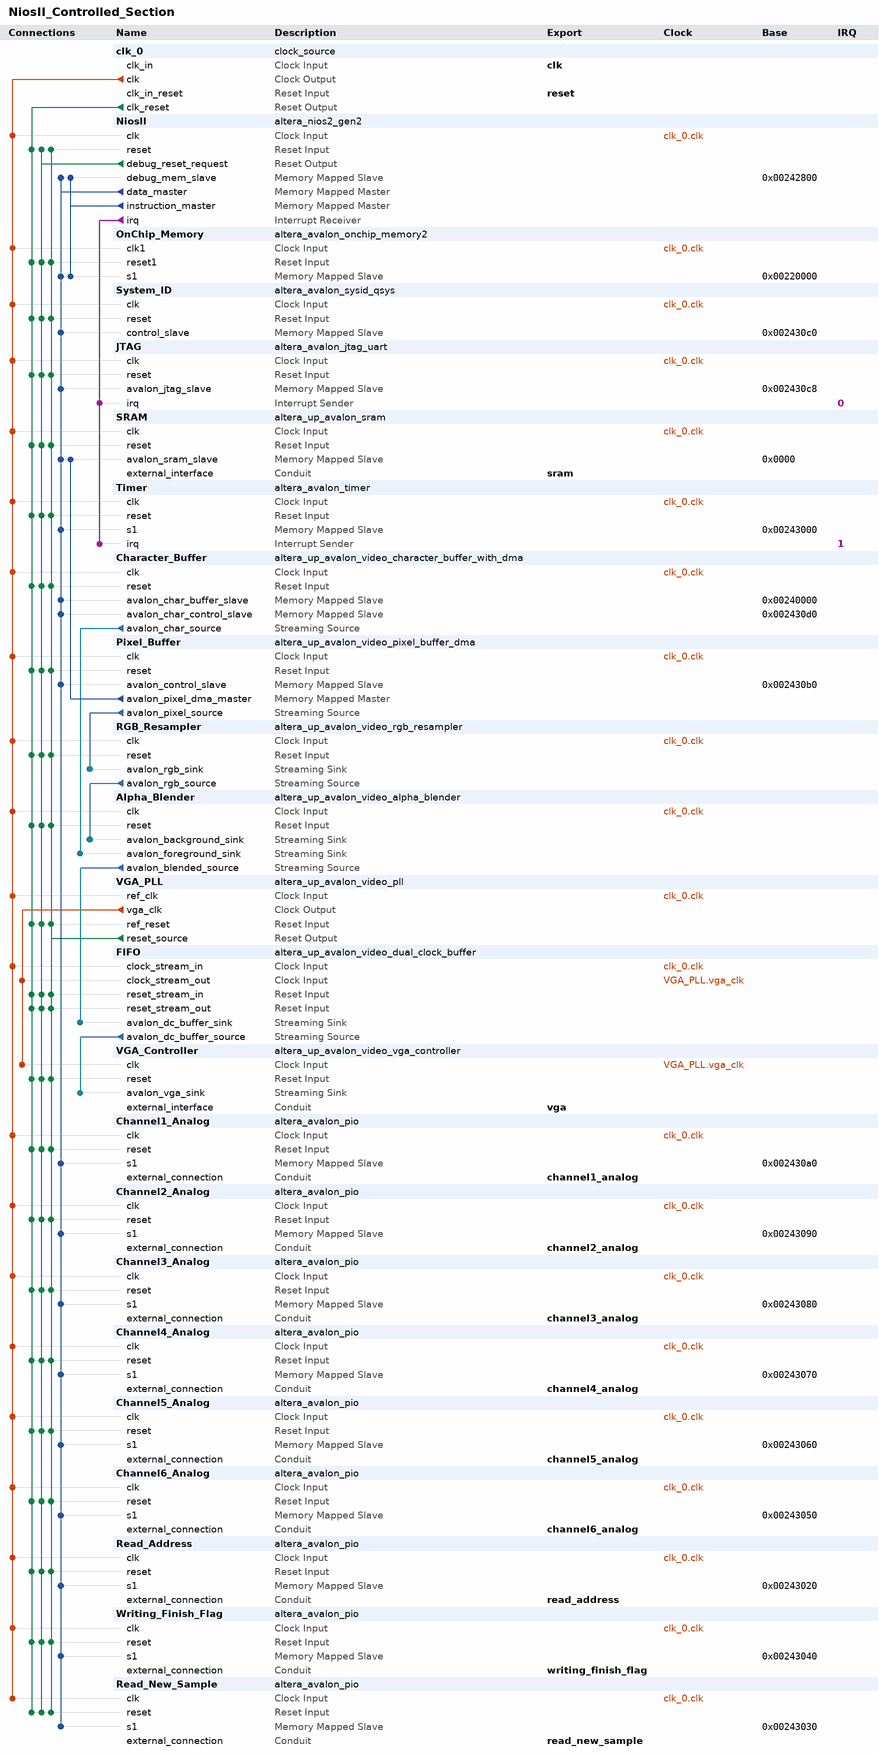
[diagram p0: system contents]
# Platform Designer (Qsys) system NiosII_Controlled_Section, Cyclone IV E EP4CE115F29C7
# Parameters at their usual value, and those the tool derives, are not listed.
package require -exact qsys 18.0
create_system NiosII_Controlled_Section
set_project_property DEVICE_FAMILY {Cyclone IV E}
set_project_property DEVICE EP4CE115F29C7

add_instance clk_0 clock_source 18.0
set_instance_parameter_value clk_0 clockFrequency 50000000

add_instance NiosII altera_nios2_gen2 18.0
set_instance_parameter_value NiosII dcache_size 2048
set_instance_parameter_value NiosII exceptionSlave OnChip_Memory.s1
set_instance_parameter_value NiosII icache_size 2048
set_instance_parameter_value NiosII impl Fast
set_instance_parameter_value NiosII resetSlave OnChip_Memory.s1

add_instance OnChip_Memory altera_avalon_onchip_memory2 18.0
set_instance_parameter_value OnChip_Memory dataWidth 32
set_instance_parameter_value OnChip_Memory dualPort false
set_instance_parameter_value OnChip_Memory initMemContent true
set_instance_parameter_value OnChip_Memory initializationFileName onchip_mem.hex
set_instance_parameter_value OnChip_Memory memorySize 100000

add_instance System_ID altera_avalon_sysid_qsys 18.0
set_instance_parameter_value System_ID id 0

add_instance JTAG altera_avalon_jtag_uart 18.0
set_instance_parameter_value JTAG simInteractiveOptions NO_INTERACTIVE_WINDOWS

add_instance SRAM altera_up_avalon_sram 18.0
set_instance_parameter_value SRAM board DE2-115
set_instance_parameter_value SRAM pixel_buffer true

add_instance Timer altera_avalon_timer 18.0
set_instance_parameter_value Timer period 1
set_instance_parameter_value Timer periodUnits MSEC

add_instance Character_Buffer altera_up_avalon_video_character_buffer_with_dma 18.0
set_instance_parameter_value Character_Buffer enable_transparency true

add_instance Pixel_Buffer altera_up_avalon_video_pixel_buffer_dma 18.0
set_instance_parameter_value Pixel_Buffer addr_mode X-Y
set_instance_parameter_value Pixel_Buffer back_start_address 1048576
set_instance_parameter_value Pixel_Buffer color_space {24-bit RGB}
set_instance_parameter_value Pixel_Buffer image_height 480
set_instance_parameter_value Pixel_Buffer image_width 640
set_instance_parameter_value Pixel_Buffer start_address 0

add_instance RGB_Resampler altera_up_avalon_video_rgb_resampler 18.0
set_instance_parameter_value RGB_Resampler alpha 1023
set_instance_parameter_value RGB_Resampler input_type {24-bit RGB}
set_instance_parameter_value RGB_Resampler output_type {30-bit RGB}

add_instance Alpha_Blender altera_up_avalon_video_alpha_blender 18.0

add_instance VGA_PLL altera_up_avalon_video_pll 18.0
set_instance_parameter_value VGA_PLL camera {5MP Digital Camera (THDB_D5M)}
set_instance_parameter_value VGA_PLL gui_refclk 50.0
set_instance_parameter_value VGA_PLL lcd {7" LCD on VEEK-MT and MTL/MTL2 Modules}

add_instance FIFO altera_up_avalon_video_dual_clock_buffer 18.0
set_instance_parameter_value FIFO color_bits 10

add_instance VGA_Controller altera_up_avalon_video_vga_controller 18.0
set_instance_parameter_value VGA_Controller board DE2-115
set_instance_parameter_value VGA_Controller resolution {VGA 640x480}

add_instance Channel1_Analog altera_avalon_pio 18.0
set_instance_parameter_value Channel1_Analog direction Input
set_instance_parameter_value Channel1_Analog width 8

add_instance Channel2_Analog altera_avalon_pio 18.0
set_instance_parameter_value Channel2_Analog direction Input
set_instance_parameter_value Channel2_Analog width 8

add_instance Channel3_Analog altera_avalon_pio 18.0
set_instance_parameter_value Channel3_Analog direction Input
set_instance_parameter_value Channel3_Analog width 8

add_instance Channel4_Analog altera_avalon_pio 18.0
set_instance_parameter_value Channel4_Analog direction Input
set_instance_parameter_value Channel4_Analog width 8

add_instance Channel5_Analog altera_avalon_pio 18.0
set_instance_parameter_value Channel5_Analog direction Input
set_instance_parameter_value Channel5_Analog width 8

add_instance Channel6_Analog altera_avalon_pio 18.0
set_instance_parameter_value Channel6_Analog direction Input
set_instance_parameter_value Channel6_Analog width 8

add_instance Read_Address altera_avalon_pio 18.0
set_instance_parameter_value Read_Address direction Output
set_instance_parameter_value Read_Address width 12

add_instance Writing_Finish_Flag altera_avalon_pio 18.0
set_instance_parameter_value Writing_Finish_Flag direction Input
set_instance_parameter_value Writing_Finish_Flag width 1

add_instance Read_New_Sample altera_avalon_pio 18.0
set_instance_parameter_value Read_New_Sample direction Input
set_instance_parameter_value Read_New_Sample width 1

# connections
add_connection clk_0.clk Alpha_Blender.clk clock
add_connection clk_0.clk Channel1_Analog.clk clock
add_connection clk_0.clk Channel2_Analog.clk clock
add_connection clk_0.clk Channel3_Analog.clk clock
add_connection clk_0.clk Channel4_Analog.clk clock
add_connection clk_0.clk Channel5_Analog.clk clock
add_connection clk_0.clk Channel6_Analog.clk clock
add_connection clk_0.clk Character_Buffer.clk clock
add_connection clk_0.clk FIFO.clock_stream_in clock
add_connection clk_0.clk JTAG.clk clock
add_connection clk_0.clk NiosII.clk clock
add_connection clk_0.clk OnChip_Memory.clk1 clock
add_connection clk_0.clk Pixel_Buffer.clk clock
add_connection clk_0.clk Read_Address.clk clock
add_connection clk_0.clk Read_New_Sample.clk clock
add_connection clk_0.clk RGB_Resampler.clk clock
add_connection clk_0.clk SRAM.clk clock
add_connection clk_0.clk System_ID.clk clock
add_connection clk_0.clk Timer.clk clock
add_connection clk_0.clk VGA_PLL.ref_clk clock
add_connection clk_0.clk Writing_Finish_Flag.clk clock
add_connection VGA_PLL.vga_clk FIFO.clock_stream_out clock
add_connection VGA_PLL.vga_clk VGA_Controller.clk clock
add_connection clk_0.clk_reset Alpha_Blender.reset reset
add_connection clk_0.clk_reset Channel1_Analog.reset reset
add_connection clk_0.clk_reset Channel2_Analog.reset reset
add_connection clk_0.clk_reset Channel3_Analog.reset reset
add_connection clk_0.clk_reset Channel4_Analog.reset reset
add_connection clk_0.clk_reset Channel5_Analog.reset reset
add_connection clk_0.clk_reset Channel6_Analog.reset reset
add_connection clk_0.clk_reset Character_Buffer.reset reset
add_connection clk_0.clk_reset FIFO.reset_stream_in reset
add_connection clk_0.clk_reset FIFO.reset_stream_out reset
add_connection clk_0.clk_reset JTAG.reset reset
add_connection clk_0.clk_reset NiosII.reset reset
add_connection clk_0.clk_reset OnChip_Memory.reset1 reset
add_connection clk_0.clk_reset Pixel_Buffer.reset reset
add_connection clk_0.clk_reset Read_Address.reset reset
add_connection clk_0.clk_reset Read_New_Sample.reset reset
add_connection clk_0.clk_reset RGB_Resampler.reset reset
add_connection clk_0.clk_reset SRAM.reset reset
add_connection clk_0.clk_reset System_ID.reset reset
add_connection clk_0.clk_reset Timer.reset reset
add_connection clk_0.clk_reset VGA_Controller.reset reset
add_connection clk_0.clk_reset VGA_PLL.ref_reset reset
add_connection clk_0.clk_reset Writing_Finish_Flag.reset reset
add_connection NiosII.debug_reset_request Alpha_Blender.reset reset
add_connection NiosII.debug_reset_request Channel1_Analog.reset reset
add_connection NiosII.debug_reset_request Channel2_Analog.reset reset
add_connection NiosII.debug_reset_request Channel3_Analog.reset reset
add_connection NiosII.debug_reset_request Channel4_Analog.reset reset
add_connection NiosII.debug_reset_request Channel5_Analog.reset reset
add_connection NiosII.debug_reset_request Channel6_Analog.reset reset
add_connection NiosII.debug_reset_request Character_Buffer.reset reset
add_connection NiosII.debug_reset_request FIFO.reset_stream_in reset
add_connection NiosII.debug_reset_request FIFO.reset_stream_out reset
add_connection NiosII.debug_reset_request JTAG.reset reset
add_connection NiosII.debug_reset_request NiosII.reset reset
add_connection NiosII.debug_reset_request OnChip_Memory.reset1 reset
add_connection NiosII.debug_reset_request Pixel_Buffer.reset reset
add_connection NiosII.debug_reset_request Read_Address.reset reset
add_connection NiosII.debug_reset_request Read_New_Sample.reset reset
add_connection NiosII.debug_reset_request RGB_Resampler.reset reset
add_connection NiosII.debug_reset_request SRAM.reset reset
add_connection NiosII.debug_reset_request System_ID.reset reset
add_connection NiosII.debug_reset_request Timer.reset reset
add_connection NiosII.debug_reset_request VGA_Controller.reset reset
add_connection NiosII.debug_reset_request VGA_PLL.ref_reset reset
add_connection NiosII.debug_reset_request Writing_Finish_Flag.reset reset
add_connection VGA_PLL.reset_source Alpha_Blender.reset reset
add_connection VGA_PLL.reset_source Channel1_Analog.reset reset
add_connection VGA_PLL.reset_source Channel2_Analog.reset reset
add_connection VGA_PLL.reset_source Channel3_Analog.reset reset
add_connection VGA_PLL.reset_source Channel4_Analog.reset reset
add_connection VGA_PLL.reset_source Channel5_Analog.reset reset
add_connection VGA_PLL.reset_source Channel6_Analog.reset reset
add_connection VGA_PLL.reset_source Character_Buffer.reset reset
add_connection VGA_PLL.reset_source FIFO.reset_stream_in reset
add_connection VGA_PLL.reset_source FIFO.reset_stream_out reset
add_connection VGA_PLL.reset_source JTAG.reset reset
add_connection VGA_PLL.reset_source NiosII.reset reset
add_connection VGA_PLL.reset_source OnChip_Memory.reset1 reset
add_connection VGA_PLL.reset_source Pixel_Buffer.reset reset
add_connection VGA_PLL.reset_source Read_Address.reset reset
add_connection VGA_PLL.reset_source Read_New_Sample.reset reset
add_connection VGA_PLL.reset_source RGB_Resampler.reset reset
add_connection VGA_PLL.reset_source SRAM.reset reset
add_connection VGA_PLL.reset_source System_ID.reset reset
add_connection VGA_PLL.reset_source Timer.reset reset
add_connection VGA_PLL.reset_source VGA_Controller.reset reset
add_connection VGA_PLL.reset_source VGA_PLL.ref_reset reset
add_connection VGA_PLL.reset_source Writing_Finish_Flag.reset reset
add_connection NiosII.data_master Channel1_Analog.s1 avalon
set_connection_parameter_value NiosII.data_master/Channel1_Analog.s1 baseAddress 0x002430a0
add_connection NiosII.data_master Channel2_Analog.s1 avalon
set_connection_parameter_value NiosII.data_master/Channel2_Analog.s1 baseAddress 0x00243090
add_connection NiosII.data_master Channel3_Analog.s1 avalon
set_connection_parameter_value NiosII.data_master/Channel3_Analog.s1 baseAddress 0x00243080
add_connection NiosII.data_master Channel4_Analog.s1 avalon
set_connection_parameter_value NiosII.data_master/Channel4_Analog.s1 baseAddress 0x00243070
add_connection NiosII.data_master Channel5_Analog.s1 avalon
set_connection_parameter_value NiosII.data_master/Channel5_Analog.s1 baseAddress 0x00243060
add_connection NiosII.data_master Channel6_Analog.s1 avalon
set_connection_parameter_value NiosII.data_master/Channel6_Analog.s1 baseAddress 0x00243050
add_connection NiosII.data_master Character_Buffer.avalon_char_buffer_slave avalon
set_connection_parameter_value NiosII.data_master/Character_Buffer.avalon_char_buffer_slave baseAddress 0x00240000
add_connection NiosII.data_master Character_Buffer.avalon_char_control_slave avalon
set_connection_parameter_value NiosII.data_master/Character_Buffer.avalon_char_control_slave baseAddress 0x002430d0
add_connection NiosII.data_master JTAG.avalon_jtag_slave avalon
set_connection_parameter_value NiosII.data_master/JTAG.avalon_jtag_slave baseAddress 0x002430c8
add_connection NiosII.data_master NiosII.debug_mem_slave avalon
set_connection_parameter_value NiosII.data_master/NiosII.debug_mem_slave baseAddress 0x00242800
add_connection NiosII.data_master OnChip_Memory.s1 avalon
set_connection_parameter_value NiosII.data_master/OnChip_Memory.s1 baseAddress 0x00220000
add_connection NiosII.data_master Pixel_Buffer.avalon_control_slave avalon
set_connection_parameter_value NiosII.data_master/Pixel_Buffer.avalon_control_slave baseAddress 0x002430b0
add_connection NiosII.data_master Read_Address.s1 avalon
set_connection_parameter_value NiosII.data_master/Read_Address.s1 baseAddress 0x00243020
add_connection NiosII.data_master Read_New_Sample.s1 avalon
set_connection_parameter_value NiosII.data_master/Read_New_Sample.s1 baseAddress 0x00243030
add_connection NiosII.data_master SRAM.avalon_sram_slave avalon
set_connection_parameter_value NiosII.data_master/SRAM.avalon_sram_slave baseAddress 0x0000
add_connection NiosII.data_master System_ID.control_slave avalon
set_connection_parameter_value NiosII.data_master/System_ID.control_slave baseAddress 0x002430c0
add_connection NiosII.data_master Timer.s1 avalon
set_connection_parameter_value NiosII.data_master/Timer.s1 baseAddress 0x00243000
add_connection NiosII.data_master Writing_Finish_Flag.s1 avalon
set_connection_parameter_value NiosII.data_master/Writing_Finish_Flag.s1 baseAddress 0x00243040
add_connection NiosII.instruction_master NiosII.debug_mem_slave avalon
set_connection_parameter_value NiosII.instruction_master/NiosII.debug_mem_slave baseAddress 0x00242800
add_connection NiosII.instruction_master OnChip_Memory.s1 avalon
set_connection_parameter_value NiosII.instruction_master/OnChip_Memory.s1 baseAddress 0x00220000
add_connection Pixel_Buffer.avalon_pixel_dma_master SRAM.avalon_sram_slave avalon
set_connection_parameter_value Pixel_Buffer.avalon_pixel_dma_master/SRAM.avalon_sram_slave baseAddress 0x0000
add_connection Alpha_Blender.avalon_blended_source FIFO.avalon_dc_buffer_sink avalon_streaming
add_connection Character_Buffer.avalon_char_source Alpha_Blender.avalon_foreground_sink avalon_streaming
add_connection FIFO.avalon_dc_buffer_source VGA_Controller.avalon_vga_sink avalon_streaming
add_connection Pixel_Buffer.avalon_pixel_source RGB_Resampler.avalon_rgb_sink avalon_streaming
add_connection RGB_Resampler.avalon_rgb_source Alpha_Blender.avalon_background_sink avalon_streaming
add_connection NiosII.irq JTAG.irq interrupt
set_connection_parameter_value NiosII.irq/JTAG.irq irqNumber 0
add_connection NiosII.irq Timer.irq interrupt
set_connection_parameter_value NiosII.irq/Timer.irq irqNumber 1

# exported interfaces
add_interface channel1_analog conduit end
set_interface_property channel1_analog EXPORT_OF Channel1_Analog.external_connection
add_interface channel2_analog conduit end
set_interface_property channel2_analog EXPORT_OF Channel2_Analog.external_connection
add_interface channel3_analog conduit end
set_interface_property channel3_analog EXPORT_OF Channel3_Analog.external_connection
add_interface channel4_analog conduit end
set_interface_property channel4_analog EXPORT_OF Channel4_Analog.external_connection
add_interface channel5_analog conduit end
set_interface_property channel5_analog EXPORT_OF Channel5_Analog.external_connection
add_interface channel6_analog conduit end
set_interface_property channel6_analog EXPORT_OF Channel6_Analog.external_connection
add_interface clk clock sink
set_interface_property clk EXPORT_OF clk_0.clk_in
add_interface read_address conduit end
set_interface_property read_address EXPORT_OF Read_Address.external_connection
add_interface read_new_sample conduit end
set_interface_property read_new_sample EXPORT_OF Read_New_Sample.external_connection
add_interface reset reset sink
set_interface_property reset EXPORT_OF clk_0.clk_in_reset
add_interface sram conduit end
set_interface_property sram EXPORT_OF SRAM.external_interface
add_interface vga conduit end
set_interface_property vga EXPORT_OF VGA_Controller.external_interface
add_interface writing_finish_flag conduit end
set_interface_property writing_finish_flag EXPORT_OF Writing_Finish_Flag.external_connection

set_interconnect_requirement {$system} qsys_mm.clockCrossingAdapter HANDSHAKE
set_interconnect_requirement {$system} qsys_mm.enableEccProtection FALSE
set_interconnect_requirement {$system} qsys_mm.insertDefaultSlave FALSE
set_interconnect_requirement {$system} qsys_mm.maxAdditionalLatency 1

save_system NiosII_Controlled_Section.qsys
